# Altium schematic sheet 2.4寸液晶屏-V1.SchDoc
size A4
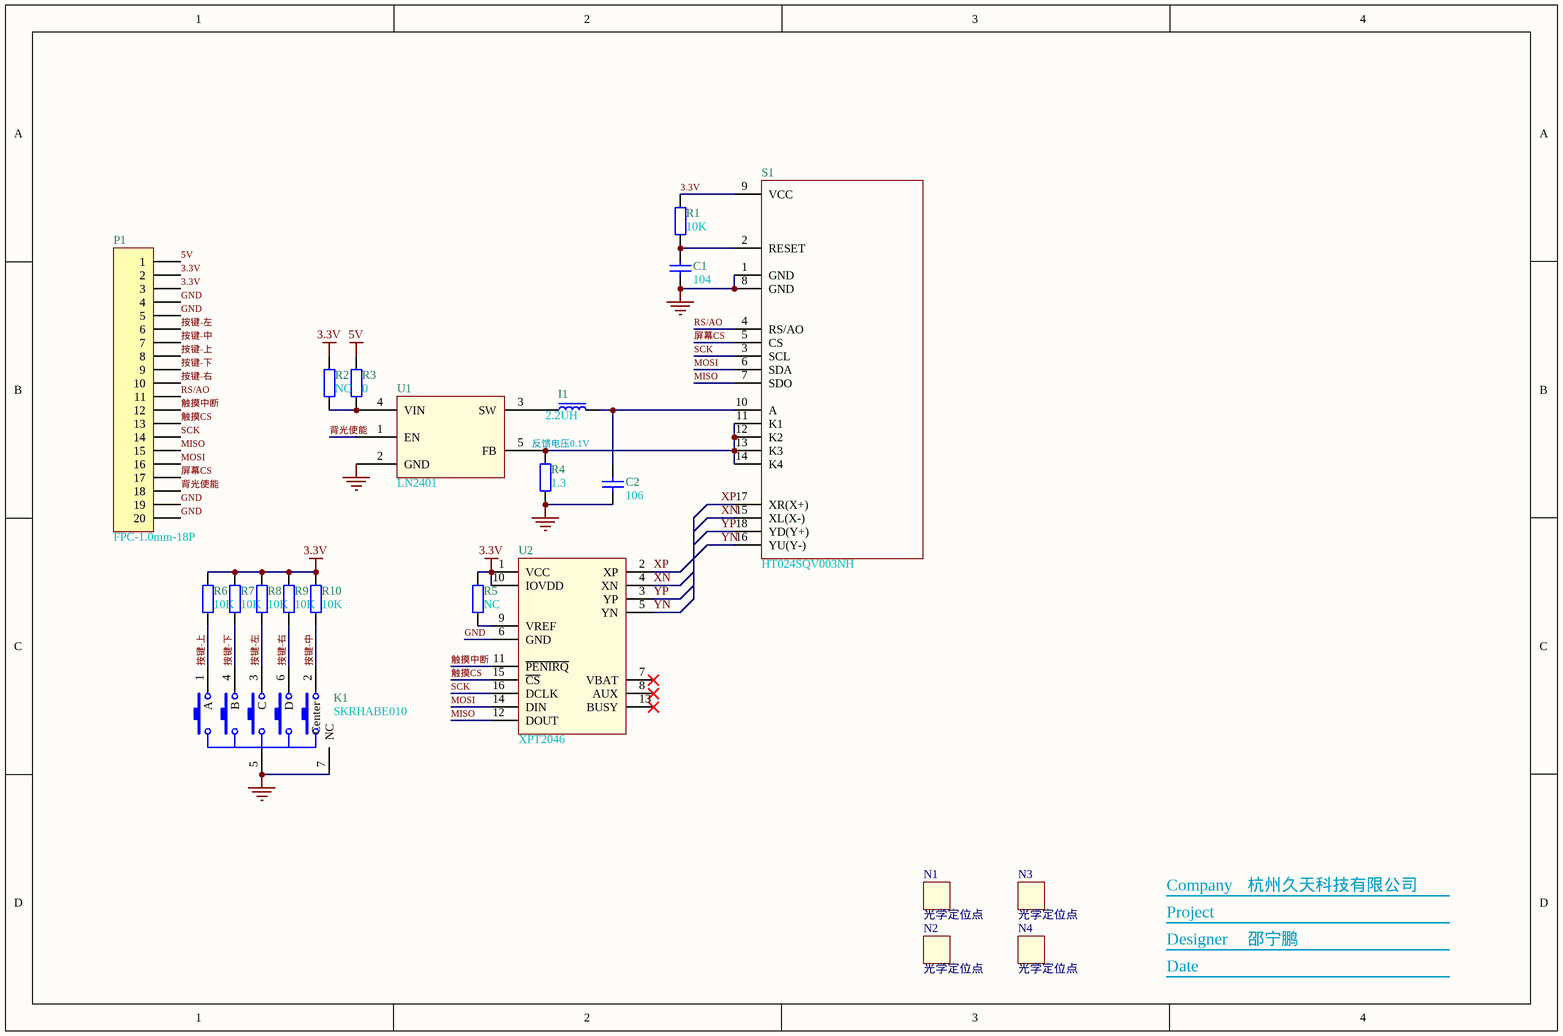
[diagram p0: 2.4寸液晶屏-V1.SchDoc]

## Parts
C1  104  [C-0603]
C2  106  [C-0603]
I1  2.2UH  [一体成型电感0420]
K1  SKRHABE010  [SKRHABE010]
N1  光学定位点  [MARK-1mm-3mm]
N2  光学定位点  [MARK-1mm-3mm]
N3  光学定位点  [MARK-1mm-3mm]
N4  光学定位点  [MARK-1mm-3mm]
P1  FPC-1.0mm-18P  [FPC-1.0mm_18P下接翻盖]
R1  10K  [R-0603]
R2  NC  [R-0603]
R3  0  [R-0603]
R4  1.3  [R-0603]
R5  NC  [R-0603]
R6  10K  [R-0603]
R7  10K  [R-0603]
R8  10K  [R-0603]
R9  10K  [R-0603]
R10  10K  [R-0603]
S1  HT024SQV003NH  [HT024SQV003NH]
U1  LN2401  [SOT-23-5-n]
U2  XPT2046  [TSSOP-16]

## Nets
3.3V: P1.2 P1.3 R1.2 R2.2 R5.1 R6.2 R7.2 R8.2 R9.2 R10.2 S1.9(VCC) U2.1(VCC) U2.10(IOVDD)
5V: P1.1 R3.2
GND: C1.1 C2.1 K1.5(Common) K1.7(NC) P1.4 P1.5 P1.19 P1.20 R4.1 S1.1(GND) S1.8(GND) U1.2(GND) U2.6(GND)
MISO: P1.15 S1.7(SDO) U2.12(DOUT)
MOSI: P1.16 S1.6(SDA) U2.14(DIN)
RS/AO: P1.11 S1.4(RS/AO)
SCK: P1.14 S1.3(SCL) U2.16(DCLK)
XN: S1.15(XL(X-)) U2.4(XN)
XP: S1.17(XR(X+)) U2.2(XP)
YN: S1.16(YU(Y-)) U2.5(YN)
YP: S1.18(YD(Y+)) U2.3(YP)
屏幕CS: P1.17 S1.5(CS)
按键-上: K1.1(A) P1.8 R6.1
按键-下: K1.4(B) P1.9 R7.1
按键-中: K1.2(Center) P1.7 R10.1
按键-右: K1.6(D) P1.10 R9.1
按键-左: K1.3(C) P1.6 R8.1
背光使能: P1.18 U1.1(EN)
触摸CS: P1.13 U2.15(~{CS})
触摸中断: P1.12 U2.11(~{PENIRQ})
NetC1_2: C1.2 R1.1 S1.2(RESET)
NetC2_2: C2.2 I1.2 S1.10(A)
NetI1_1: I1.1 U1.3(SW)
NetR2_1: R2.1 R3.1 U1.4(VIN)
NetR4_2: R4.2 S1.11(K1) S1.12(K2) S1.13(K3) S1.14(K4) U1.5(FB)
NetR5_2: R5.2 U2.9(VREF)

Not connected (* = marked no-connect by the designer): U2 7(VBAT)* 8(AUX)* 13(BUSY)*

## Notes on the sheet
- (near R4) 反馈电压0.1V
- Project
- Company
- 杭州久天科技有限公司
- Designer
- Date
- 邵宁鹏

## Library data of the parts
C1 = Cap-0603: 0805; Published: 8-Jun-2000; LatestRevisionDate: 17-Jul-2002; LatestRevisionNote: Re-released for DXP Platform.; PackageReference: RAD-0.3; Publisher: Altium Limited
C2 = Cap-0805: 0805; Published: 8-Jun-2000; LatestRevisionDate: 17-Jul-2002; LatestRevisionNote: Re-released for DXP Platform.; PackageReference: RAD-0.3; Publisher: Altium Limited
I1 = Inductance3
K1 = SKRHABE010: 五向开关
N1-N4 = 无引脚
P1 = Header 20: Header, 20-Pin; LatestRevisionDate: 17-Jul-2002; LatestRevisionNote: Re-released for DXP Platform.; Publisher: Altium Limited
R1-R3 R5-R10 = Res2-0603: 0603; Published: 8-Jun-2000; LatestRevisionDate: 17-Jul-2002; LatestRevisionNote: Re-released for DXP Platform.; PackageReference: AXIAL-0.4; Publisher: Altium Limited
R4 = Res2: 0805; Published: 8-Jun-2000; LatestRevisionDate: 17-Jul-2002; LatestRevisionNote: Re-released for DXP Platform.; PackageReference: AXIAL-0.4; Publisher: Altium Limited
U1 = PAM2804: DC-DC降压